# Altium schematic sheet Power.SchDoc
size A4; SheetNumber: 3; SheetTotal: 3
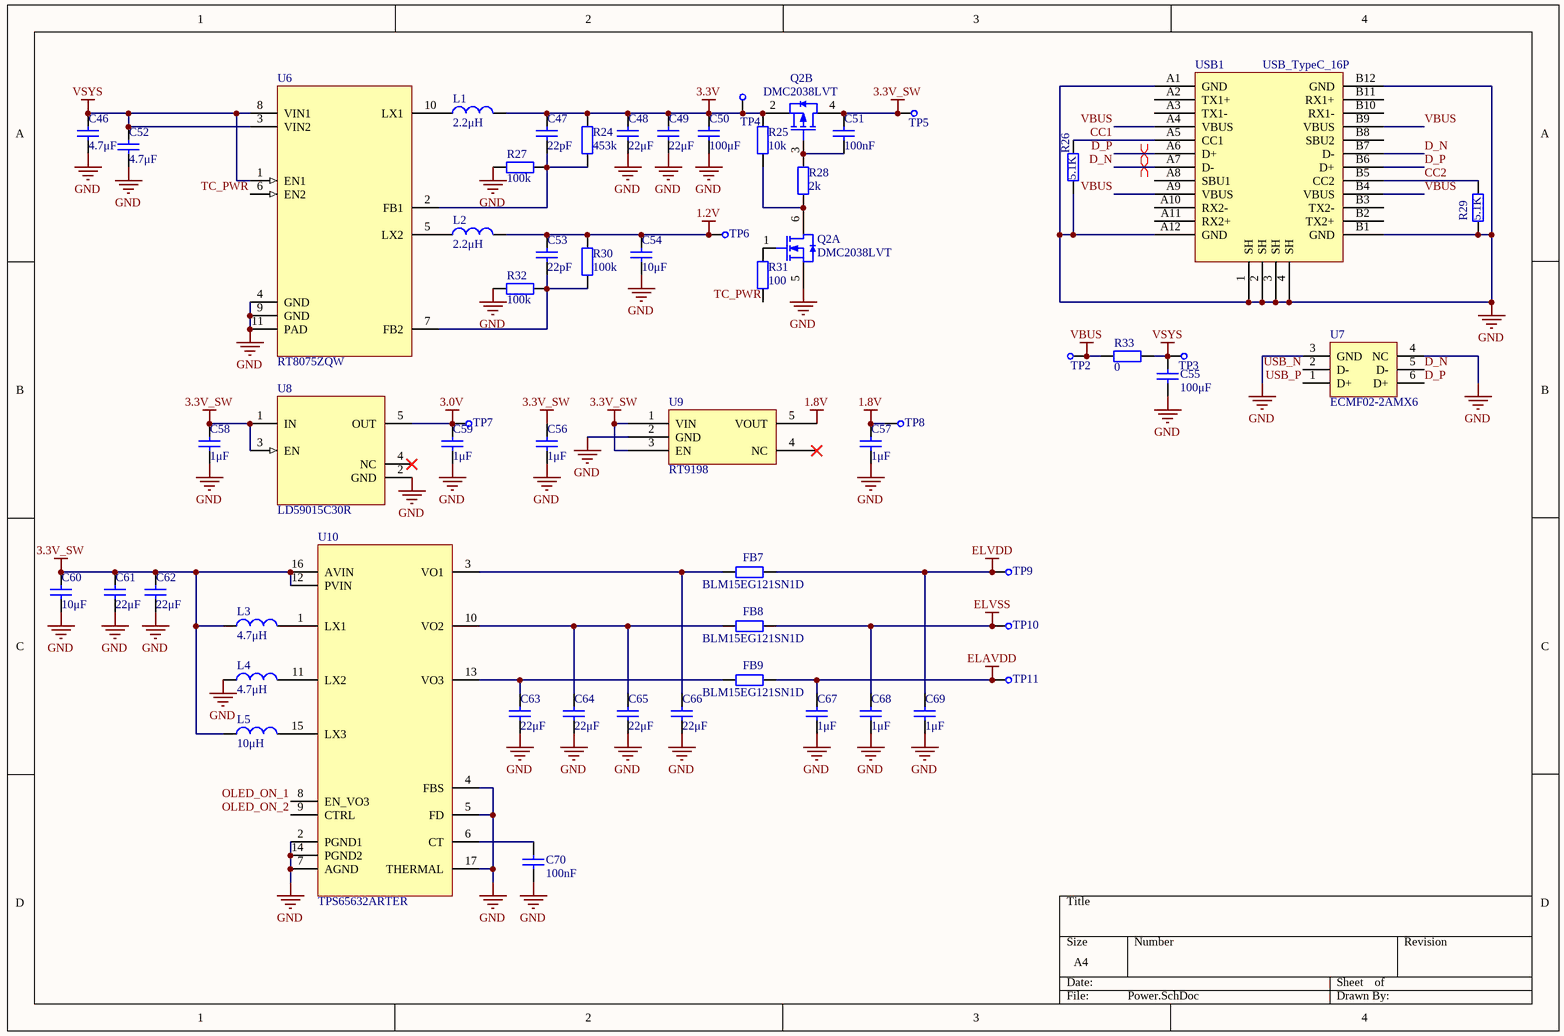
[diagram p0: Power.SchDoc]

## Parts
C46  value 4.7μF  [0402C]  (hidden comment: Cap)
C47  value 22pF  [0402C]  (hidden comment: Cap)
C48  value 22μF  [0805C]  (hidden comment: Cap)
C49  value 22μF  [0805C]  (hidden comment: Cap)
C50  value 100μF  [1206C]  (hidden comment: Cap)
C51  value 100nF  [0402C]  (hidden comment: Cap)
C52  value 4.7μF  [0402C]  (hidden comment: Cap)
C53  value 22pF  [0402C]  (hidden comment: Cap)
C54  value 10μF  [0603C]  (hidden comment: Cap)
C55  value 100μF  [1206C]  (hidden comment: Cap)
C56  value 1μF  [0402C]  (hidden comment: Cap)
C57  value 1μF  [0402C]  (hidden comment: Cap)
C58  value 1μF  [0402C]  (hidden comment: Cap)
C59  value 1μF  [0402C]  (hidden comment: Cap)
C60  value 10μF  [0603C]  (hidden comment: Cap)
C61  value 22μF  [0805C]  (hidden comment: Cap)
C62  value 22μF  [0805C]  (hidden comment: Cap)
C63  value 22μF  [0805C]  (hidden comment: Cap)
C64  value 22μF  [0805C]  (hidden comment: Cap)
C65  value 22μF  [0805C]  (hidden comment: Cap)
C66  value 22μF  [0805C]  (hidden comment: Cap)
C67  value 1μF  [0402C]  (hidden comment: Cap)
C68  value 1μF  [0402C]  (hidden comment: Cap)
C69  value 1μF  [0402C]  (hidden comment: Cap)
C70  value 100nF  [0402C]  (hidden comment: Cap)
FB7  value BLM15EG121SN1D  [0402R]  (hidden comment: Resistor)
FB8  value BLM15EG121SN1D  [0402R]  (hidden comment: Resistor)
FB9  value BLM15EG121SN1D  [0402R]  (hidden comment: Resistor)
L1  value 2.2μH  [IND-SMD_L3.0-W3.0_FNR30XXS]  (hidden comment: Inductor)
L2  value 2.2μH  [IND-SMD_L3.0-W3.0_FNR30XXS]  (hidden comment: Inductor)
L3  value 4.7μH  [IND-SMD_L2.5-W2.0-1]  (hidden comment: Inductor)
L4  value 4.7μH  [IND-SMD_L2.5-W2.0-1]  (hidden comment: Inductor)
L5  value 10μH  [IND-SMD_L3.0-W3.0_FNR30XXS]  (hidden comment: Inductor)
Q2  DMC2038LVT  [SOT-23-6]  (parts A,B of 2)
R24  value 453k  [0402R]  (hidden comment: Resistor)
R25  value 10k  [0402R]  (hidden comment: Resistor)
R26  value 5.1K  [0402R]  (hidden comment: Resistor)
R27  value 100k  [0402R]  (hidden comment: Resistor)
R28  value 2k  [0402R]  (hidden comment: Resistor)
R29  value 5.1K  [0402R]  (hidden comment: Resistor)
R30  value 100k  [0402R]  (hidden comment: Resistor)
R31  value 100  [0402R]  (hidden comment: Resistor)
R32  value 100k  [0402R]  (hidden comment: Resistor)
R33  value 0  [0805R]  (hidden comment: Resistor)
TP2  CHECK  [CHECK-B]  (value not drawn)
TP3  CHECK  [CHECK-B]  (value not drawn)
TP4  CHECK  [CHECK-B]  (value not drawn)
TP5  CHECK  [CHECK-B]  (value not drawn)
TP6  CHECK  [CHECK-B]  (value not drawn)
TP7  CHECK  [CHECK-B]  (value not drawn)
TP8  CHECK  [CHECK-B]  (value not drawn)
TP9  CHECK  [CHECK-B]  (value not drawn)
TP10  CHECK  [CHECK-B]  (value not drawn)
TP11  CHECK  [CHECK-B]  (value not drawn)
U6  RT8075ZQW  [DFN-10_L3.0_W3.0_P0.5]
U7  ECMF02-2AMX6  [DFN-6_L1.5_W1.7_P0.5]
U8  LD59015C30R  [SC-70(SC-70-5)]
U9  RT9198  [SOT-23-5]
U10  TPS65632ARTER  [QFN-16_L3.0_W3.0]
USB1  USB_TypeC_16P  [USB3.0-TYPE-C-SMD_16PIN-H-PITCH0.50]

## Nets
1.2V: C53.2 C54.2 L2.2 R30.2 TP6.1
1.8V: C57.2 TP8.1 U9.5(VOUT)
3.0V: C59.2 TP7.1 U8.5(OUT)
3.3V: C47.2 C48.2 C49.2 C50.2 L1.2 Q2.2(S) R24.2 R25.1 TP4.1
3.3V_SW: C51.2 C56.2 C58.2 C60.2 C61.2 C62.2 L3.1 L5.1 Q2.4(D) TP5.1 U8.1(IN) U8.3(EN) U9.1(VIN) U9.3(EN) U10.12(PVIN) U10.16(AVIN)
ELAVDD: C67.2 FB9.2 TP11.1
ELVDD: C69.2 FB7.2 TP9.1
ELVSS: C68.2 FB8.2 TP10.1
GND: C46.1 C48.1 C49.1 C50.1 C52.1 C54.1 C55.1 C56.1 C57.1 C58.1 C59.1 C60.1 C61.1 C62.1 C63.1 C64.1 C65.1 C66.1 C67.1 C68.1 C69.1 C70.1 L4.1 Q2.5(S) R26.1 R27.2 R29.1 R32.2 U6.4(GND) U6.9(GND) U6.11(PAD) U7.3(GND) U7.4(NC) U8.2(GND) U9.2(GND) U10.2(PGND1) U10.4(FBS) U10.5(FD) U10.7(AGND) U10.14(PGND2) U10.17(THERMAL) USB1.1(SH) USB1.2(SH) USB1.3(SH) USB1.4(SH) USB1.A1(GND) USB1.A12(GND) USB1.B1(GND) USB1.B12(GND)
VBUS: R33.1 TP2.1 USB1.A4(VBUS) USB1.A9(VBUS) USB1.B4(VBUS) USB1.B9(VBUS)
VSYS: C46.2 C52.2 C55.2 R33.2 TP3.1 U6.1(EN1) U6.3(VIN2) U6.8(VIN1)
CC1: R26.2 USB1.A5(CC1)
CC2: R29.2 USB1.B5(CC2)
D_N: U7.5(D-) USB1.A7(D-) USB1.B7(D-)
D_P: U7.6(D+) USB1.A6(D+) USB1.B6(D+)
OLED_ON_1: U10.8(EN_VO3)
OLED_ON_2: U10.9(CTRL)
TC_PWR: R31.2 U6.6(EN2)
USB_N: U7.2(D-)
USB_P: U7.1(D+)
NetC47_1: C47.1 R24.1 R27.1 U6.2(FB1)
NetC51_1: C51.1 Q2.3(G) R28.1
NetC53_1: C53.1 R30.1 R32.1 U6.7(FB2)
NetC63_2: C63.2 FB9.1 U10.13(VO3)
NetC64_2: C64.2 C65.2 FB8.1 U10.10(VO2)
NetC66_2: C66.2 FB7.1 U10.3(VO1)
NetC70_2: C70.2 U10.6(CT)
NetL1_1: L1.1 U6.10(LX1)
NetL2_1: L2.1 U6.5(LX2)
NetL3_2: L3.2 U10.1(LX1)
NetL4_2: L4.2 U10.11(LX2)
NetL5_2: L5.2 U10.15(LX3)
NetQ2_1: Q2.1(G) R31.1
NetQ2_6: Q2.6(D) R25.2 R28.2

Not connected (* = marked no-connect by the designer): U8 4(NC)*; U9 4(NC)*; USB1 A2(TX1+) A3(TX1-) A8(SBU1) A10(RX2-) A11(RX2+) B2(TX2+) B3(TX2-) B8(SBU2) B10(RX1-) B11(RX1+)

## Layout directives
differential pair: D_N, D_P

## Library data of the parts
C46-C70 = Cap: 无极性电容; Published: 8-Jun-2000; LatestRevisionDate: 17-Jul-2002; LatestRevisionNote: Re-released for DXP Platform.; PackageReference: RAD-0.3; Publisher: Altium Limited
FB7-FB9 R24-R33 = Resistor: 电阻; Published: 8-Jun-2000; LatestRevisionDate: 17-Jul-2002; LatestRevisionNote: Re-released for DXP Platform.; PackageReference: AXIAL-0.4; Publisher: Altium Limited
L1-L5 = Inductor: 电感; Code_IEC: 1005; Published: 8-Jun-2000; LatestRevisionDate: 17-Jul-2002; LatestRevisionNote: Re-released for DXP Platform.; PackageReference: 0402-A; Publisher: Altium Limited; Code_JEITA: 0402
Q2 = DMC2038LVT: Dual P + N MOS
TP2-TP11 = CHECK: 测试点
U6 = RT8075ZQW: IC, DUAL STEP DOWN CONVERTER, 1A, 1.25MHz; Manufacturer: RICHTEK; Part Number: RT8075ZQW; Pinout verified: *
U7 = ECMF02-2AMX6: IC, COMMON MODE FILTER WITH ESD PROTECTION FOR MIPI; Manufacturer: STMICROELECTRONICS; Part Number: ECMF02-2AMX6; Verified Pinout: *
U8 = LD59015C30R: IC, LDO REGULATOR, 3.0V, 150mA, HIGH PSRR; Manufacturer: STMICROELECTRONICS; Part Number: LD59015C30R; Pinout verified: *
U9 = RT9198: LDO
U10 = TPS65632ARTER: IC, TRIPLE OUTPUT AMOLED DISPLAY POWER SUPPLY; Manufacturer: TEXAS INSTRUMENTS; Part Number: TPS65632ARTER
USB1 = USB_TypeC: TypeC Connector; pin to pad: A1>A1B12 A2>none A3>none A4>A4B9 A9>A9B4 A10>none A11>none A12>A12B1 B1>A12B1 B2>none B3>none B4>A9B4 B9>A4B9 B10>none B11>none B12>A1B12